# Altium schematic sheet Digital.SchDoc
size A3; SheetNumber: 2; SheetTotal: 2
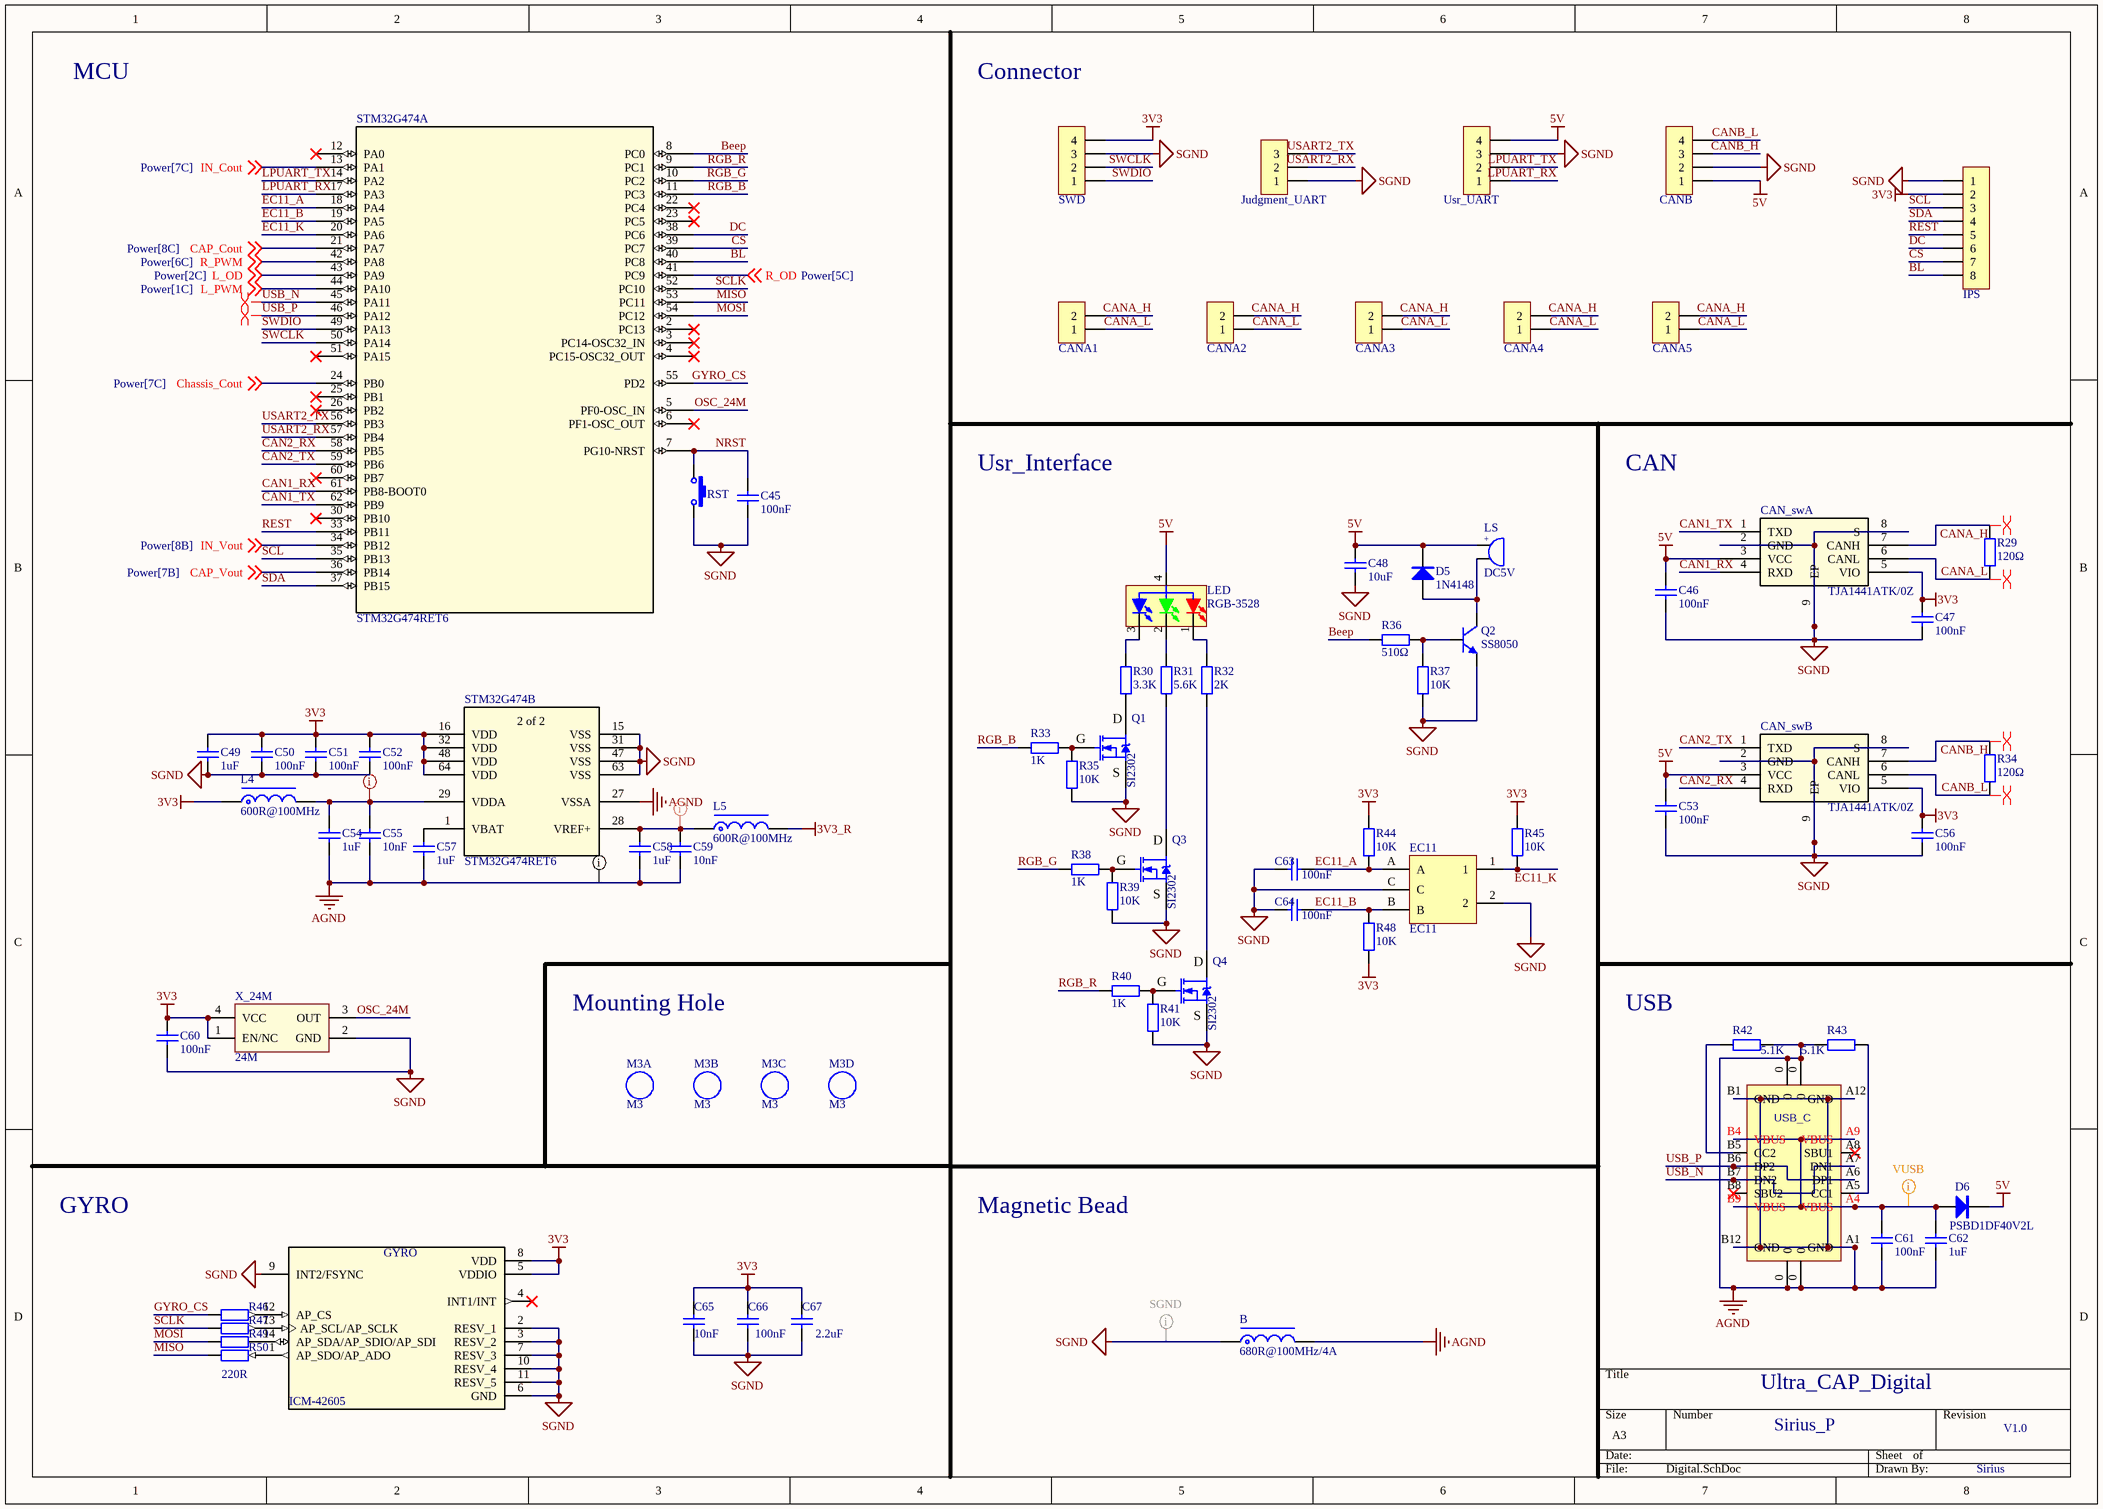
[diagram p0: Digital.SchDoc]

## Parts
B  680R@100MHz/4A  [R1812_L]
C45  100nF  [C0603_L]
C46  100nF  [C0603_L]
C47  100nF  [C0603_L]
C48  10uF  [C0603_L]
C49  1uF  [C0603_L]
C50  100nF  [C0603_L]
C51  100nF  [C0603_L]
C52  100nF  [C0603_L]
C53  100nF  [C0603_L]
C54  1uF  [C0603_L]
C55  10nF  [C0603_L]
C56  100nF  [C0603_L]
C57  1uF  [C0603_L]
C58  1uF  [C0603_L]
C59  10nF  [C0603_L]
C60  100nF  [C0603_L]
C61  100nF  [C0603_L]
C62  1uF  [C0603_L]
C63  100nF  [C0603_L]
C64  100nF  [C0603_L]
C65  10nF  [C0603_L]
C66  100nF  [C0603_L]
C67  2.2uF  [C0603_L]
CAN_swA  TJA1441ATK/0Z  [SON65P300X300X100-9N-D]
CAN_swB  TJA1441ATK/0Z  [SON65P300X300X100-9N-D]
CANA1  HDR-1X2  [CONN-SMD_2P-P1.25_JUSHUO_GH125-S02DCA-00]  (value not drawn)
CANA2  HDR-1X2  [CONN-SMD_2P-P1.25_JUSHUO_GH125-S02DCA-00]  (value not drawn)
CANA3  HDR-1X2  [CONN-SMD_2P-P1.25_JUSHUO_GH125-S02DCA-00]  (value not drawn)
CANA4  HDR-1X2  [CONN-SMD_2P-P1.25_JUSHUO_GH125-S02DCA-00]  (value not drawn)
CANA5  HDR-1X2  [CONN-SMD_2P-P1.25_JUSHUO_GH125-S02DCA-00]  (value not drawn)
CANB  HDR-1X4  [CONN-SMD_4P-P1.27_GH125-S04DCA-00]  (value not drawn)
D5  1N4148  [SOD-323]
D6  PSBD1DF40V2L  [SOD-123]
EC11  EC11  [EC11]
GYRO  ICM-42605  [PQFN50P300X250X97-14N - duplicate]
IPS  HDR-1X8  [HDR2.54-M-LI-8P]  (value not drawn)
Judgment_UART  HDR-1X3  [CONN-SMD_3P-P1.25_JUSHUO_GH125-S03DCA-00]  (value not drawn)
L4  600R@100MHz  [R0603_L]
L5  600R@100MHz  [R0603_L]
LED  RGB-3528  [LED 3528-4Pin]
LS  DC5V  [BEEP 5x9x5.5]
M3A  M3  [M3 125X200]
M3B  M3  [M3 125X200]
M3C  M3  [M3 125X200]
M3D  M3  [M3 125X200]
Q1  SI2302  [SOT23-3N]
Q2  SS8050  [SOT23-3N]
Q3  SI2302  [SOT23-3N]
Q4  SI2302  [SOT23-3N]
R29  120Ω  [R0603_L]
R30  3.3K  [R0603_L]
R31  5.6K  [R0603_L]
R32  2K  [R0603_L]
R33  1K  [R0603_L]
R34  120Ω  [R0603_L]
R35  10K  [R0603_L]
R36  510Ω  [R0603_L]
R37  10K  [R0603_L]
R38  1K  [R0603_L]
R39  10K  [R0603_L]
R40  1K  [R0603_L]
R41  10K  [R0603_L]
R42  5.1K  [R0603_L]
R43  5.1K  [R0603_L]
R44  10K  [R0603_L]
R45  10K  [R0603_L]
R46  220R  [R0603_L]
R47  220R  [R0603_L]  (value not drawn)
R48  10K  [R0603_L]
R49  220R  [R0603_L]  (value not drawn)
R50  220R  [R0603_L]  (value not drawn)
RST  3x6x5  [SW SMD-3*6*5]  (value not drawn)
STM32G474  STM32G474RET6  [LQFP64-10*10]  (parts A,B of 2)
SWD  HDR-1X4  [MX1.25-WS-4P]  (value not drawn)
USB_C  TYPE-C 2.0 -16P  [USB-C-SMD_16P]  (value not drawn)
Usr_UART  HDR-1X4  [CONN-SMD_4P-P1.27_GH125-S04DCA-00]  (value not drawn)
X_24M  24M  [OSC-2025-4P]

## Nets
3V3: C47.2 C49.2 C50.2 C51.2 C52.1 C56.2 C60.2 C65.2 C66.2 C67.2 CAN_swA.5(VIO) CAN_swB.5(VIO) GYRO.5(VDDIO) GYRO.8(VDD) IPS.2 L4.1 R44.1 R45.1 R48.2 STM32G474.16(VDD) STM32G474.32(VDD) STM32G474.48(VDD) STM32G474.64(VDD) SWD.4 X_24M.1(EN/NC) X_24M.4(VCC)
3V3_R: L5.2
5V: C46.2 C48.2 C53.2 CAN_swA.3(VCC) CAN_swB.3(VCC) CANB.1 D5.2(K) D6.2(K) LED.4(A) LS.1 Usr_UART.4
AGND: B.2 C54.1 C55.1 C57.1 C58.1 C59.1 C61.1 C62.1 R42.2 R43.1 STM32G474.27(VSSA) USB_C.0 USB_C.A1(GND) USB_C.A12(GND) USB_C.B1(GND) USB_C.B12(GND)
SGND: B.1 C45.1 C46.1 C47.1 C48.1 C49.1 C50.1 C51.1 C52.2 C53.1 C56.1 C60.1 C63.1 C64.1 C65.1 C66.1 C67.1 CAN_swA.2(GND) CAN_swA.8(S) CAN_swA.9(EP) CAN_swB.2(GND) CAN_swB.8(S) CAN_swB.9(EP) CANB.2 EC11.2 EC11.C GYRO.2(RESV_1) GYRO.3(RESV_2) GYRO.6(GND) GYRO.7(RESV_3) GYRO.9(INT2/FSYNC) GYRO.10(RESV_4) GYRO.11(RESV_5) IPS.1 Judgment_UART.1 Q1.2(S) Q2.2(E) Q3.2(S) Q4.2(S) R35.2 R37.2 R39.2 R41.2 RST.2 STM32G474.15(VSS) STM32G474.31(VSS) STM32G474.47(VSS) STM32G474.63(VSS) SWD.3 Usr_UART.3 X_24M.2(GND)
Beep: R36.2 STM32G474.8(PC0)
BL: IPS.8 STM32G474.40(PC8)
CAN1_RX: CAN_swA.4(RXD) STM32G474.61(PB8-BOOT0)
CAN1_TX: CAN_swA.1(TXD) STM32G474.62(PB9)
CAN2_RX: CAN_swB.4(RXD) STM32G474.58(PB5)
CAN2_TX: CAN_swB.1(TXD) STM32G474.59(PB6)
CANA_H: CAN_swA.7(CANH) CANA1.2 CANA2.2 CANA3.2 CANA4.2 CANA5.2 R29.2
CANA_L: CAN_swA.6(CANL) CANA1.1 CANA2.1 CANA3.1 CANA4.1 CANA5.1 R29.1
CANB_H: CAN_swB.7(CANH) CANB.3 R34.2
CANB_L: CAN_swB.6(CANL) CANB.4 R34.1
CAP_Cout: STM32G474.21(PA7) ; off-sheet CAP_Cout
CAP_Vout: STM32G474.36(PB14) ; off-sheet CAP_Vout
Chassis_Cout: STM32G474.24(PB0) ; off-sheet Chassis_Cout
CS: IPS.7 STM32G474.39(PC7)
DC: IPS.6 STM32G474.38(PC6)
EC11_A: C63.2 EC11.A R44.2 STM32G474.18(PA4)
EC11_B: C64.2 EC11.B R48.1 STM32G474.19(PA5)
EC11_K: EC11.1 R45.2 STM32G474.20(PA6)
GYRO_CS: R46.1 STM32G474.55(PD2)
IN_Cout: STM32G474.13(PA1) ; off-sheet IN_Cout
IN_Vout: STM32G474.34(PB12) ; off-sheet IN_Vout
L_OD: STM32G474.43(PA9) ; off-sheet L_OD
L_PWM: STM32G474.44(PA10) ; off-sheet L_PWM
LPUART_RX: STM32G474.17(PA3) Usr_UART.1
LPUART_TX: STM32G474.14(PA2) Usr_UART.2
MISO: R50.1 STM32G474.53(PC11)
MOSI: R49.1 STM32G474.54(PC12)
NRST: C45.2 RST.1 STM32G474.7(PG10-NRST)
OSC_24M: STM32G474.5(PF0-OSC_IN) X_24M.3(OUT)
R_OD: STM32G474.41(PC9) ; off-sheet R_OD
R_PWM: STM32G474.42(PA8) ; off-sheet R_PWM
REST: IPS.5 STM32G474.33(PB11)
RGB_B: R33.2 STM32G474.11(PC3)
RGB_G: R38.2 STM32G474.10(PC2)
RGB_R: R40.2 STM32G474.9(PC1)
SCL: IPS.3 STM32G474.35(PB13)
SCLK: R47.1 STM32G474.52(PC10)
SDA: IPS.4 STM32G474.37(PB15)
SWCLK: STM32G474.50(PA14) SWD.2
SWDIO: STM32G474.49(PA13) SWD.1
USART2_RX: Judgment_UART.2 STM32G474.57(PB4)
USART2_TX: Judgment_UART.3 STM32G474.56(PB3)
USB_N: STM32G474.45(PA11) USB_C.A7(DN1) USB_C.B7(DN2)
USB_P: STM32G474.46(PA12) USB_C.A6(DP1) USB_C.B6(DP2)
NetC54_2: C54.2 C55.2 L4.2 STM32G474.29(VDDA)
NetC57_2: C57.2 STM32G474.1(VBAT)
NetC58_2: C58.2 C59.2 L5.1 STM32G474.28(VREF+)
NetC61_2: C61.2 C62.2 D6.1(A) USB_C.A4(VBUS) USB_C.A9(VBUS) USB_C.B4(VBUS) USB_C.B9(VBUS)
NetD5_1: D5.1(A) LS.2 Q2.3(C)
NetGYRO_1: GYRO.1(AP_SDO/AP_ADO) R50.2
NetGYRO_12: GYRO.12(AP_CS) R46.2
NetGYRO_13: GYRO.13(AP_SCL/AP_SCLK) R47.2
NetGYRO_14: GYRO.14(AP_SDA/AP_SDIO/AP_SDI) R49.2
NetLED_1: LED.1(RED_K) R32.2
NetLED_2: LED.2(GREEN_K) R31.2
NetLED_3: LED.3(BULE_K) R30.2
NetQ1_1: Q1.1(G) R33.1 R35.1
NetQ1_3: Q1.3(D) R30.1
NetQ2_1: Q2.1(B) R36.1 R37.1
NetQ3_1: Q3.1(G) R38.1 R39.1
NetQ3_3: Q3.3(D) R31.1
NetQ4_1: Q4.1(G) R40.1 R41.1
NetQ4_3: Q4.3(D) R32.1
NetR42_1: R42.1 USB_C.B5(CC2)
NetR43_2: R43.2 USB_C.A5(CC1)

Not connected (* = marked no-connect by the designer): GYRO 4(INT1/INT)*; STM32G474 2(PC13)* 3(PC14-OSC32_IN)* 4(PC15-OSC32_OUT)* 6(PF1-OSC_OUT)* 12(PA0)* 22(PC4)* 23(PC5)* 25(PB1)* 26(PB2)* 30(PB10)* 51(PA15)* 60(PB7)*; USB_C A8(SBU1)* B8(SBU2)*

## Layout directives
differential pair; rule Signal Stimulus [Kind - Periodic Pulse    Level - High    Start Time = 0.000    Stop Time = 41.67n    Period Time = 83.33n]: USB_N, USB_P
differential pair: CANA_H, CANA_L, CANB_H, CANB_L
net class Power_Class; rule Supply Nets [Voltage = 5.000]: NetC61_2
rule Supply Nets [Voltage = 3.300]; net class Power_Class: NetC54_2, NetC58_2
rule Supply Nets [Voltage = 0.000]; net class Power_Class: AGND, SGND

## Notes on the sheet
- MCU
- Connector
- Usr_Interface
- CAN
- Mounting Hole
- USB
- GYRO
- Magnetic Bead
- Ultra_CAP_Digital
- Sirius_P
- V1.0
- Sirius
- (in symbol BEEP) +
- (in symbol STM32G474RET6, part B) 2 of 2

## Library data of the parts
B L4 L5 = FB: 磁珠; BOM名称: 直插磁珠; 联系卖家，免费查找封装: 唯一出售店铺网址https://shop463601444.taobao.com
C45-C64 = C: 贴片电容; BOM名称: 无极性贴片电容; 联系卖家，免费查找封装: 唯一出售店铺网址https://shop463601444.taobao.com
C65 = C: VDDIO滤波电容; BOM名称: 无极性贴片电容; 联系卖家，免费查找封装: 唯一出售店铺网址https://shop463601444.taobao.com
C66 C67 = C: VDD滤波电容; BOM名称: 无极性贴片电容; 联系卖家，免费查找封装: 唯一出售店铺网址https://shop463601444.taobao.com
CAN_swA CAN_swB = TJA1441ATK/0Z: CAN电平转换芯片; Mfr_Name: NXP; Manufacturer_Part_Number: TJA1441BTK/0Z; Copyright: Copyright (C) 2022 Ultra Librarian. All rights reserved.; RefDes: RefDes; Type: DEV
CANA1-CANA5 = Header 2: 2P连接器; 联系卖家，免费技术支持: 唯一出售店铺网址https://shop463601444.taobao.com; 联系卖家 免费技术支持: 封装库来自淘宝卖家ID：黄晶宝石; BOM名称: 2P连接器
CANB SWD Usr_UART = Header 4: 4P连接器; 联系卖家，免费技术支持: 唯一出售店铺网址https://shop463601444.taobao.com; 联系卖家 免费技术支持: 封装库来自淘宝卖家ID：黄晶宝石; BOM名称: 4P连接器
D5 = 1N4148: 开关二极管; BOM名称: 高速开关二极管; 联系卖家，免费查找封装: 唯一出售店铺网址https://shop463601444.taobao.com
D6 = 1N5822: 肖特基二极管; 联系卖家，免费查找封装: 唯一出售店铺网址https://shop463601444.taobao.com; BOM名称: 肖特基二极管
EC11 = EC11: 数字开关编码器; BOM名称: 数字编码开关; 联系卖家，免费查找封装: 唯一出售店铺网址https://shop463601444.taobao.com; 封装库来自淘宝卖家ID：黄晶宝石: 其他店铺购入均为盗版假冒封装库，请立即申请退款
GYRO = ICM-42605: Accelerometer, Gyroscope, 6 Axis Sensor IÂ²C, I3Câ„ , SPI Output; MF: TDK InvenSense; Value: *; MP: ICM-42605; Package: - TDK InvenSense; SnapEDA_Link: https://www.snapeda.com/parts/ICM-42605/TDK%20InvenSense/view-part/3226540/?ref=snap; Digi-Key_Part_Number: 1428-1152-1-ND; Digi-Key_Purchase_URL: https://www.digikey.com.cn/product-detail/zh/tdk-invensense/ICM-42605/1428-1152-1-ND/9953675?utm_source=snapeda&utm_medium=aggregator&utm_campaign=symbol
IPS = Header 8: 8P接插件; 封装库来自淘宝卖家 ID：黄晶宝石: 其他店铺购入均为盗版假冒封装库; 联系卖家，免费查找封装: 唯一出售店铺网址https://shop463601444.taobao.com; BOM名称: 8P接插件
Judgment_UART = Header 3: 3P连接器; 联系卖家，免费技术支持: 唯一出售店铺网址https://shop463601444.taobao.com; 联系卖家 免费技术支持: 封装库来自淘宝卖家ID：黄晶宝石; BOM名称: 3P连接器
LED = LED-RGB 3528: 3528三基色LED; BOM名称: 三基色LED; 联系卖家 免费查找封装: 封装库来自淘宝卖家ID：黄晶宝石
LS = BEEP: 蜂鸣器; 联系卖家，免费查找封装: 唯一出售店铺网址https://shop463601444.taobao.com; 封装库来自淘宝卖家ID：黄晶宝石: 其他店铺购入均为盗版假冒封装库，请立即申请退款; BOM名称: 蜂鸣器
M3A M3B M3C M3D = M3: 铜柱孔; 联系卖家，免费查找封装: 唯一出售店铺网址https://shop463601444.taobao.com; 封装库来自淘宝卖家ID：黄晶宝石: 其他店铺购入均为盗版假冒封装库，请立即申请退款; BOM名称: 铜柱孔
Q1 Q3 Q4 = AO3400: N沟道 20V/6A; BOM名称: 场效应管; 联系卖家，免费查找封装: 唯一出售店铺网址https://shop463601444.taobao.com; 参数: N沟道 30V/4.2A
Q2 = 8050-SMD: 高频放大-NPN型; 联系卖家，免费查找封装: 唯一出售店铺网址https://shop463601444.taobao.com; 参数: 40V 1.5A 1W 100MHZ; BOM名称: 高频放大-NPN型
R29-R50 = R: 贴片电阻; 联系卖家，免费查找封装: 唯一出售店铺网址https://shop463601444.taobao.com; BOM名称: 贴片电阻
RST = SW 3x6: 3x6轻触开关; 联系卖家，免费查找封装: 唯一出售店铺网址https://shop463601444.taobao.com; 封装库来自淘宝卖家ID：黄晶宝石: 其他店铺购入均为盗版假冒封装库，请立即申请退款; BOM名称: 3x6轻触开关
STM32G474 = STM32G474RET6: MCU; Mfr_Name: STMicroelectronics; Copyright: Copyright (C) 2022 Ultra Librarian. All rights reserved.; Manufacturer_Part_Number: STM32G474RET6; RefDes: RefDes; Type: DEV
USB_C = USB2.0_Type-C_16Pin: USB2.0 Type-C 16Pin  母座; 联系卖家，免费技术支持: 唯一出售店铺网址https://shop463601444.taobao.com
X_24M = XTAL-ACT-4P: 4脚有源晶振(振荡器); 联系卖家，免费查找封装: 唯一出售店铺网址https://shop463601444.taobao.com; BOM名称: 有源晶振(振荡器)